# Altium schematic sheet SPIflash.SchDoc
size A
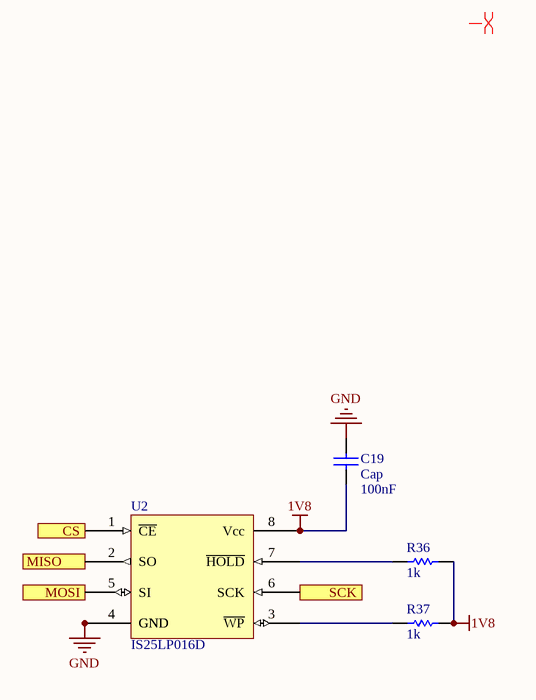
[diagram p0: SPIflash.SchDoc]

## Parts
C19  Cap  value 100nF  [0402-A]
R36  value 1k  [0402-A]  (hidden comment: Res1)
R37  value 1k  [0402-A]  (hidden comment: Res1)
U2  IS25LP016D  [IS25LP016D]

## Ports
CS (in), MISO (out), MOSI (in), SCK (in)

## Nets
1V8: C19.1 R36.1 R37.1 U2.8(Vcc)
GND: C19.2 U2.4(GND) U2.9(GND)
CS: U2.1(~{CE}) ; port CS
MISO: U2.2(SO) ; port MISO
MOSI: U2.5(SI) ; port MOSI
SCK: U2.6(SCK) ; port SCK
NetR36_2: R36.2 U2.7(~{HOLD})
NetR37_2: R37.2 U2.3(~{WP})

## Layout directives
differential pair: (no net found under the mark)

## Library data of the parts
C19 = Cap: Capacitor; Published: 8-Jun-2000; LatestRevisionDate: 17-Jul-2002; LatestRevisionNote: Re-released for DXP Platform.; PackageReference: RAD-0.3; Publisher: Altium Limited; PackageDescription: Radial Cap, Thru-Hole; 2 Leads; 0.3 in Pin Spacing
R36 R37 = Res1: Resistor; Published: 8-Jun-2000; LatestRevisionDate: 17-Jul-2002; LatestRevisionNote: Re-released for DXP Platform.; PackageReference: AXIAL-0.3; Publisher: Altium Limited; PackageDescription: Axial Device, Thru-Hole; 2 Leads; 0.3 in Pin Spacing